# EAGLE design MotorDriver (EAGLE 7.1.0)
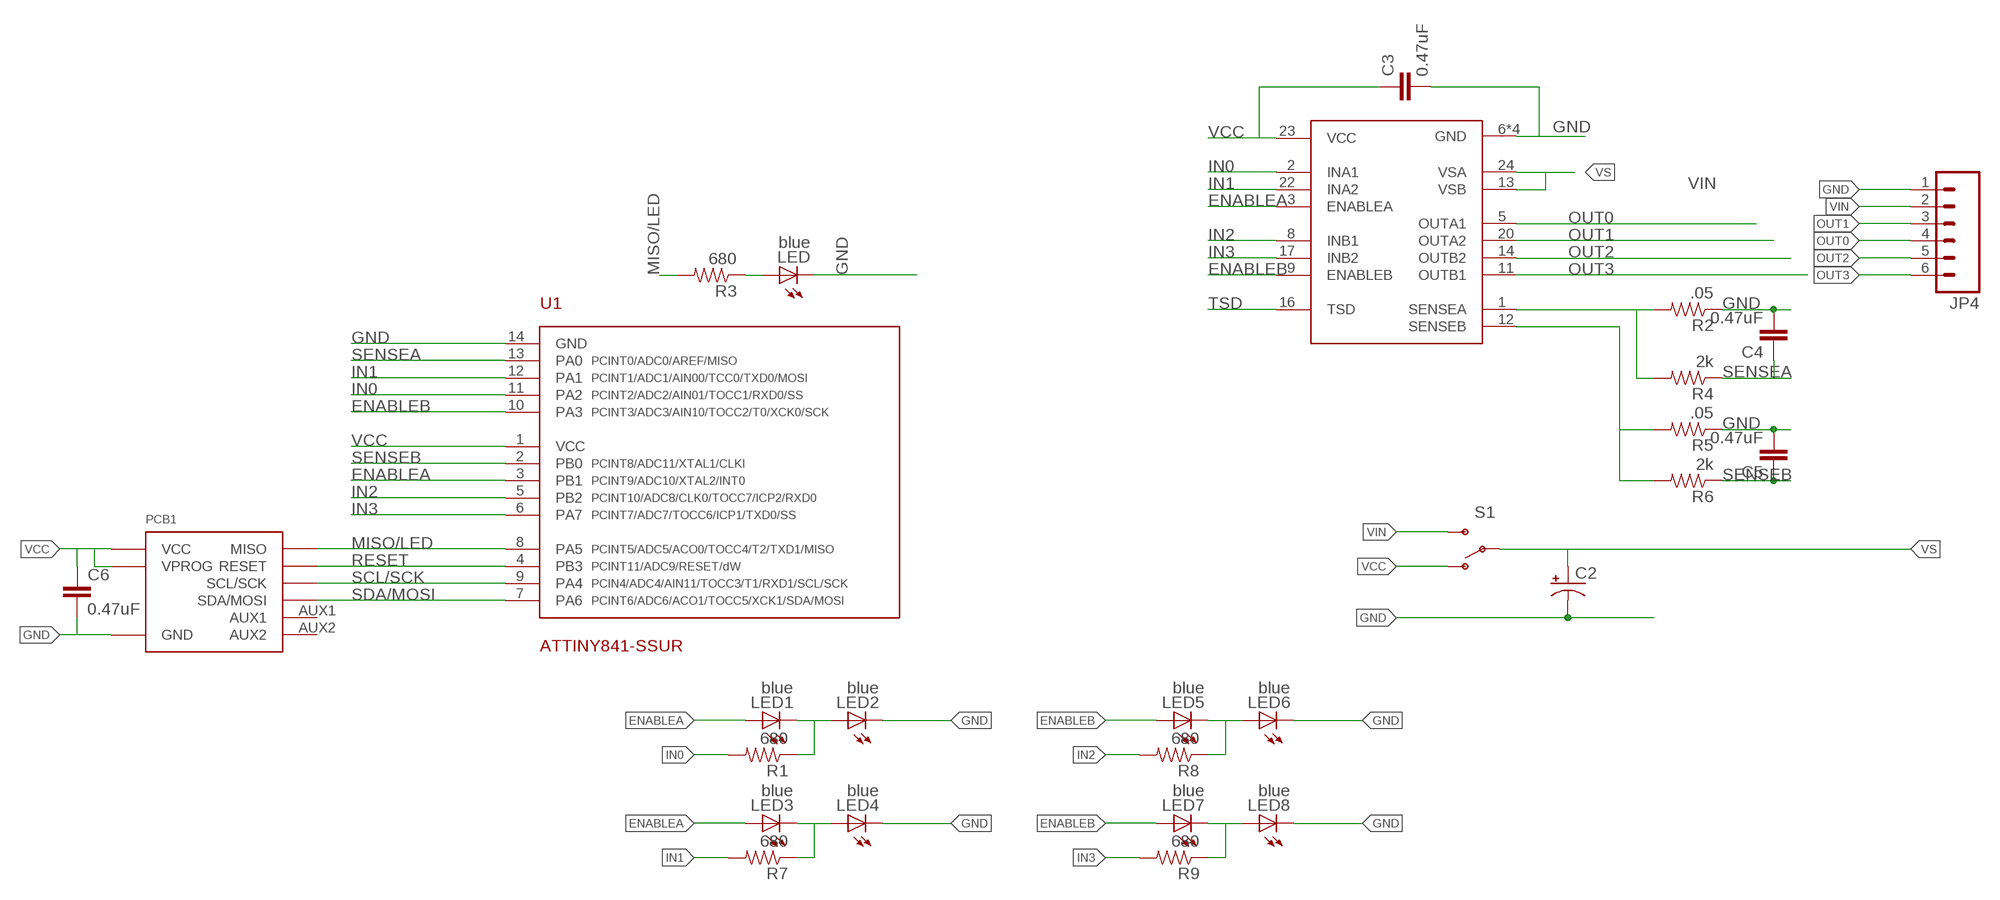
[diagram p0: schematic, sheet 1]

## Parts
C2  CAP_POLC  [PANASONIC_C]
C3  0.47uF  CAP0805  [0805]
C4  0.47uF  CAP0805  [0805]
C5  0.47uF  CAP0805  [0805]
C6  0.47uF  CAP0805  [0805]
JP4  M063.5MM-6  [SCREWTERMINAL-3.5MM-6]
LED  blue  LED-0805-BLUE  [0805-LED]
LED1  blue  LED-0805-BLUE  [0805-LED]
LED2  blue  LED-0805-BLUE  [0805-LED]
LED3  blue  LED-0805-BLUE  [0805-LED]
LED4  blue  LED-0805-BLUE  [0805-LED]
LED5  blue  LED-0805-BLUE  [0805-LED]
LED6  blue  LED-0805-BLUE  [0805-LED]
LED7  blue  LED-0805-BLUE  [0805-LED]
LED8  blue  LED-0805-BLUE  [0805-LED]
PCB1  MAGDEVICE-V2-DOUBLE  [MAGDEVICE-V2-DOUBLE]
R1  680  RESISTOR0805-RES  [0805]
R2  .05  RESISTOR0805-RES  [0805]
R3  680  RESISTOR0805-RES  [0805]
R4  2k  RESISTOR0805-RES  [0805]
R5  .05  RESISTOR0805-RES  [0805]
R6  2k  RESISTOR0805-RES  [0805]
R7  680  RESISTOR0805-RES  [0805]
R8  680  RESISTOR0805-RES  [0805]
R9  680  RESISTOR0805-RES  [0805]
S1  SWITCH-SPDTPTH_LOCK  [SWITCH-SPDT_LOCK.007S]
U1  ATTINY841-SSUR  ATTINY841  [SOIC-14]
U2  NJM2670  [SOP-24-E3]

## Nets
ENABLEA: LED1.A LED3.A U1.3(PB1) U2.3(ENABLEA)
ENABLEB: LED5.A LED7.A U1.10(PA3) U2.9(ENABLEB)
GND: C2.- C3.2 C4.2 C5.2 C6.2 JP4.1 LED2.C LED4.C LED6.C LED8.C LED.C PCB1.GND R2.1 R5.1 U1.14(GND) U2.6(GND) U2.7(GND) U2.18(GND) U2.19(GND)
IN0: R1.2 U1.11(PA2) U2.2(INA1)
IN1: R7.2 U1.12(PA1) U2.22(INA2)
IN2: R8.2 U1.5(PB2) U2.8(INB1)
IN3: R9.2 U1.6(PA7) U2.17(INB2)
MISO/LED: PCB1.MISO R3.2 U1.8(PA5)
N$1: LED1.C LED2.A R1.1
N$2: R2.2 R4.2 U2.1(SENSEA)
N$3: R5.2 R6.2 U2.12(SENSEB)
N$4: LED3.C LED4.A R7.1
N$5: LED.A R3.1
N$6: LED5.C LED6.A R8.1
N$7: LED7.C LED8.A R9.1
OUT0: JP4.4 U2.5(OUTA1)
OUT1: JP4.3 U2.20(OUTA2)
OUT2: JP4.5 U2.14(OUTB2)
OUT3: JP4.6 U2.11(OUTB1)
RESET: PCB1.RESET U1.4(PB3)
SCL/SCK: PCB1.SCL(SCL/SCK) U1.9(PA4)
SDA/MOSI: PCB1.SDA(SDA/MOSI) U1.7(PA6)
SENSEA: C4.1 R4.1 U1.13(PA0)
SENSEB: C5.1 R6.1 U1.2(PB0)
TSD: U2.16(TSD)
VCC: C3.1 C6.1 PCB1.VCC PCB1.VPROG S1.1(O) U1.1(VCC) U2.23(VCC)
VIN: JP4.2 S1.3(S)
VS: C2.+ S1.2(P) U2.13(VSB) U2.24(VSA)
Unconnected: PCB1.AUX1 PCB1.AUX2

## Library data of the parts
C2 = SparkFun-Capacitors:CAP_POL: Capacitor Polarized These are standard SMD and PTH capacitors. Normally 10uF, 47uF, and 100uF in electrolytic and tantalum varieties. Always verify the external diameter of the through hole cap, it varies with capacity, voltage, and manufacturer. The EIA devices should be standard.
C3-C6 = SparkFun-Capacitors:CAP: Capacitor Standard 0603 ceramic capacitor, and 0.1" leaded capacitor.
JP4 = SparkFun-Connectors:M06: Header 6 Standard 6-pin 0.1" header. Use with straight break away headers (SKU : PRT-00116), right angle break away headers (PRT-00553), swiss pins (PRT-00743), machine pins (PRT-00117), and female headers (PRT-00115). Molex polarized connector foot print use with SKU : PRT-08094 with associated crimp pins and housings. NOTES ON THE VARIANTS LOCK and LOCK_LONGPADS... This footprint was designed to help hold the alignment of a through-hole component (i.e. 6-pin header) while soldering it into place. You may notice that each hole has been shifted either up or down by 0.005 of an inch from it's more standard position (which is a perfectly straight line). This slight alteration caused the pins (the squares in the middle) to touch the edges of the holes. Because they are alternating, it causes a "brace" to hold the component in place. 0.005 has proven to be the perfect amount of "off-center" position when using our standard breakaway headers. Although looks a little odd when you look at the bare footprint, once you have a header in there, the alteration is very hard to notice. Also,if you push a header all the way into place, it is covered up entirely on the bottom side. This idea of altering the position of holes to aid alignment will be further integrated into the Sparkfun Library for other footprints. It can help hold any component with 3 or more connection pins.
LED LED1-LED8 = Modulo:LED: LED; PARTNUM: LTST-C171TBKT
PCB1 = Modulo:MAGDEVICE
R1-R9 = SparkFun-Passives:RESISTOR: Resistor Basic schematic elements and footprints for 0603, 1206, and PTH resistors.
S1 = SparkFun-Electromechanical:SWITCH-SPDT: SPDT Switch Simple slide switch, Spark Fun Electronics SKU : COM-00102 DPDT SMT slide switch, AYZ0202, SWCH-08179
U1 = Modulo:ATTINY841
U2 = IntegerLabs:NJM2670

## Board
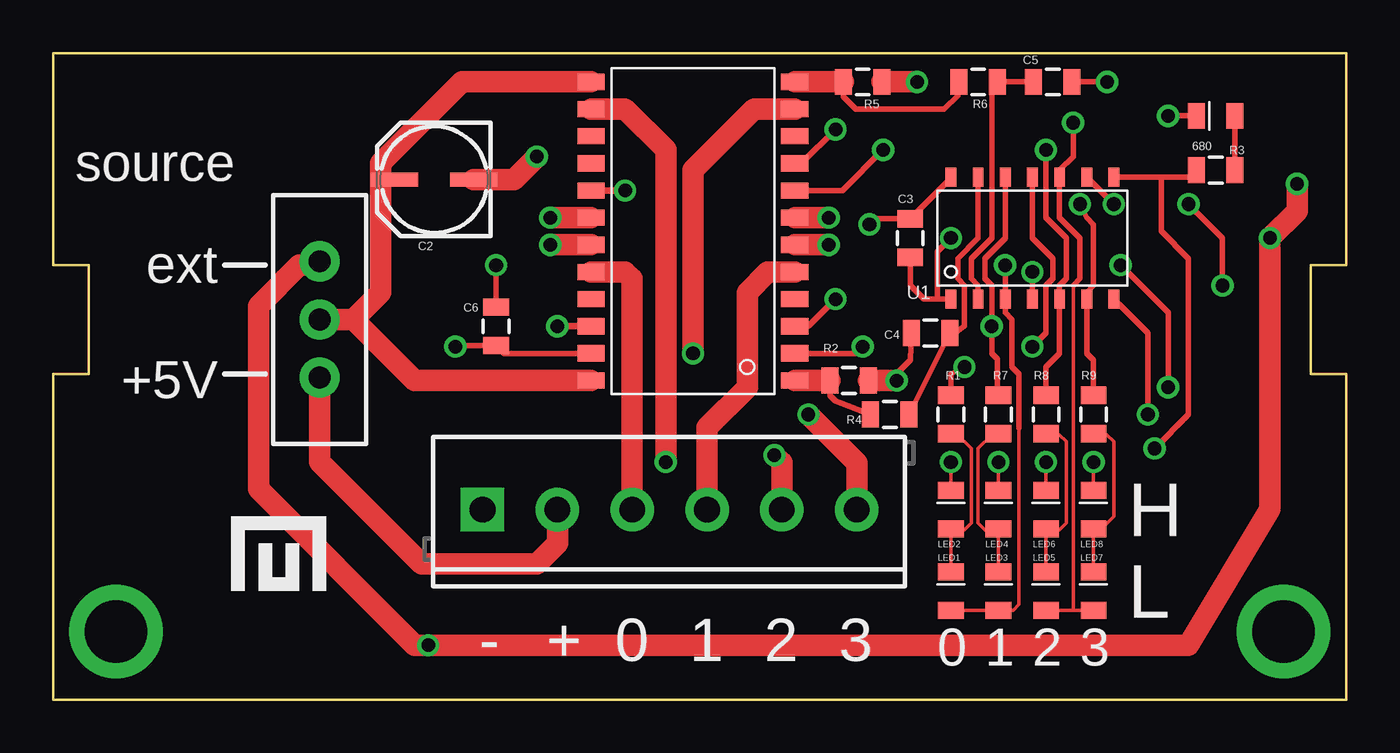
[diagram p1: board, top side]
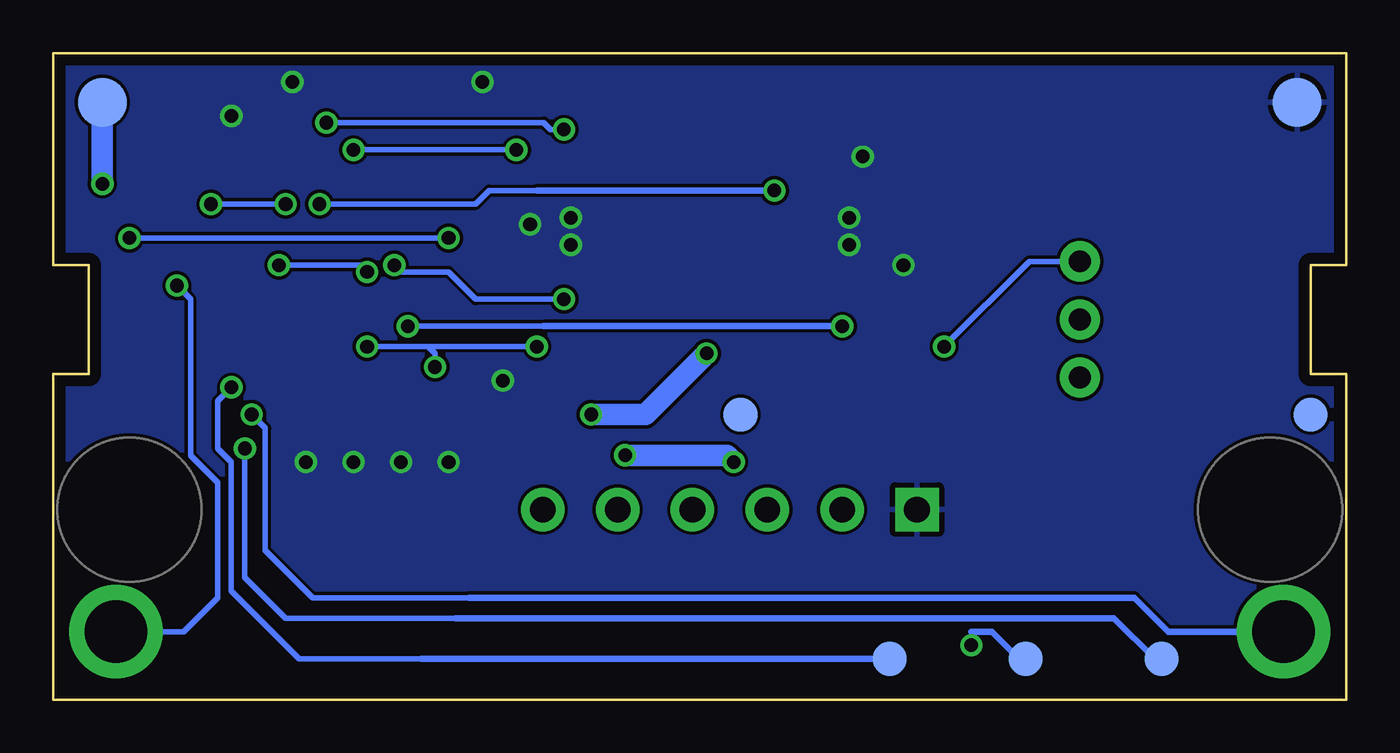
[diagram p2: board, bottom side, seen from below]

Size 60.45 x 30.23 mm. Coordinates in mm from the lower left corner, seen from the top.
Copper layers (1*16): Top 0.0178mm / dielectric 59mil / Bottom 0.0178mm
Design rules "SSC-EAGLE-2Lyr_v1.0.0.3": minimum track width 6mil, minimum drill 14mil, track to track 6mil, track to pad 6mil, pad to pad 6mil, via to via 6mil, smd to smd 6mil, copper to edge 20mil, drill to drill 16mil, minimum pad ring 8mil, minimum via ring 8mil, stop-mask expansion 3mil, vias tented up to drill 0mil, thermal gap 10mil

### Footprints (pad centres in the part's own frame; a part is rotated, then mirrored left to right if it is on the bottom)
PANASONIC_C = smd 2.2 x 0.65: + 1.9,-0.2; - -1.8,-0.2
0805 = smd 0.8 x 1.2: 1 -0.9,0; 2 0.9,0
SCREWTERMINAL-3.5MM-6 = drill 1.2 pad 2.032 square: 1 0,0 | drill 1.2 pad 2.032: 2 3.5,0; 3 7,0; 4 10.5,0; 5 14,0; 6 17.5,0
0805-LED = smd 1.2 x 0.8: A 0,-0.9; C 0,0.9
MAGDEVICE-V2-DOUBLE = smd 1.587 x 1.587 bottom: AUX1 1.905,13.335; AUX2 28.575,13.335; MISO 8.89,1.905; RESET 21.59,1.905; VPROG 15.24,1.905 | smd 2.286 x 2.286 bottom: GND 2.54,27.94; VCC 58.42,27.94 | drill 2.921: SCL 57.785,3.175; SDA 3.175,3.175
SWITCH-SPDT_LOCK.007S = drill 1.016 pad 1.88: 1 0,2.718; 2 0,0; 3 0,-2.718
SOIC-14 = smd 0.508 x 0.889: 1 0,-3.175; 2 1.27,-3.175; 3 2.54,-3.175; 4 3.81,-3.175; 5 5.08,-3.175; 6 6.35,-3.175; 7 7.62,-3.175; 8 7.62,2.54; 9 6.35,2.54; 10 5.08,2.54; 11 3.81,2.54; 12 2.54,2.54; 13 1.27,2.54; 14 0,2.54
SOP-24-E3 = smd 0.762 x 1.27: 1 -6.35,-4.445; 2 -5.08,-4.445; 3 -3.81,-4.445; 4 -2.54,-4.445; 5 -1.27,-4.445; 6 0,-4.445; 7 1.27,-4.445; 8 2.54,-4.445; 9 3.81,-4.445; 10 5.08,-4.445; 11 6.35,-4.445; 12 7.62,-4.445; 13 7.62,5.08; 14 6.35,5.08; 15 5.08,5.08; 16 3.81,5.08; 17 2.54,5.08; 18 1.27,5.08; 19 0,5.08; 20 -1.27,5.08; 21 -2.54,5.08; 22 -3.81,5.08; 23 -5.08,5.08; 24 -6.35,5.08

### Placement (x,y rotation side)
C2  17.84,24.13 180 top
C3  40.07,21.59 90 top
C4  41.02,17.14 180 top
C5  46.74,28.89 0 top
C6  20.7,17.46 90 top
JP4  20.07,8.89 0 top
LED  54.36,27.3 90 top
LED1  41.97,5.08 0 top
LED2  41.97,8.89 0 top
LED3  44.2,5.08 0 top
LED4  44.2,8.89 0 top
LED5  46.42,5.08 0 top
LED6  46.42,8.89 0 top
LED7  48.64,5.08 0 top
LED8  48.64,8.89 0 top
PCB1  -0.25,0 0 top
R1  41.97,13.34 90 top
R2  37.21,14.92 180 top
R3  54.36,24.77 180 top
R4  39.12,13.34 180 top
R5  37.85,28.89 180 top
R6  43.24,28.89 180 top
R7  44.2,13.34 90 top
R8  46.42,13.34 90 top
R9  48.64,13.34 90 top
S1  12.45,17.78 0 top
U1  41.97,21.91 0 top
U2  30.23,21.27 90 top

### Tracks (layer width: path | path; a pad name or v marks a point on that pad's centre or on a via)
ENABLEA  (via drill 0.64)
  Top 0.159: LED1.A LED3.A 44.88,4.18 45.15,4.45 45.15,12.7
  Top 0.254: U2.3 35.31,17.46 v36.58,18.73 | v44.51,20.32 U1.3 44.51,18.1 44.83,17.78 44.83,15.56 45.15,15.24 45.15,12.7
  Bottom 0.254: v36.58,18.73 40.7,18.73 41.97,20 44.51,20 v44.51,20.32
ENABLEB  (via drill 0.64)
  Top 0.159: LED7.A 47.69,4.18 | 47.69,4.18 LED5.A | 47.69,19.37 47.69,4.18
  Top 0.254: v47.69,26.99 47.69,25.4 47.05,24.77 U1.10 47.05,22.54 48.01,21.59 48.01,19.68 47.69,19.37 | U2.9 34.99,25.08 v36.58,26.67
  Bottom 0.254: v47.69,26.99 37.53,26.99 37.21,26.67 v36.58,26.67
GND  (via drill 0.64)
  Top 0.159: LED2.C v41.97,11.11 | LED4.C v44.2,11.11 | LED6.C v46.42,11.11 | LED8.C v48.64,11.11
  Top 0.254: C6.2 v20.7,20.32 | U1.14 41.97,24.39 C3.2 38.43,22.49 v38.16,22.23 | v39.43,14.92 39.43,15.24 40.07,15.88 C4.2 | C5.2 v49.28,28.89 | LED.C v52.13,27.3
  Top 1.016: U2.6 v36.26,21.27 | U2.7 v36.26,22.54 | U2.18 v23.24,22.54 | U2.19 v23.24,21.27 | R5.1 v40.39,28.89 | R2.1 v39.43,14.92 | C2.- 21.54,24.33 v22.61,25.4
  pour Bottom: -0.25,0 -0.25,30.48 60.71,30.48 60.71,0
IN0  (via drill 0.64)
  Top 0.254: U2.2 37.53,16.19 v37.85,16.51 | v45.78,16.51 46.42,17.14 46.42,19.37 46.74,19.68 46.74,20.64 45.78,21.59 U1.11 | R1.2 41.97,15.24 v42.61,15.56
  Bottom 0.254: v37.85,16.51 42.93,16.51 | 42.93,16.51 v45.78,16.51 | v42.61,15.56 42.61,16.19 42.93,16.51
IN1  (via drill 0.64)
  Top 0.254: U1.12 44.51,21.59 43.56,20.64 43.56,19.68 43.88,19.37 v43.88,17.46 43.88,16.19 44.14,15.93 44.14,14.29 R7.2
  Top 0.305: U2.22 v23.56,17.46
  Bottom 0.254: 37.53,17.46 v43.88,17.46
  Bottom 0.305: v23.56,17.46 37.53,17.46
IN2  (via drill 0.64)
  Top 0.254: v46.42,25.72 46.42,22.54 47.37,21.59 47.37,19.68 47.05,19.37 U1.5 47.05,16.19 46.42,15.56 R8.2 | U2.8 36.89,23.81 v38.8,25.72
  Bottom 0.254: v46.42,25.72 v38.8,25.72
IN3  (via drill 0.64)
  Top 0.254: v48.01,23.18 48.32,22.54 48.64,22.23 48.64,19.37 48.32,19.05 U1.6 48.32,16.19 48.64,15.88 R9.2
  Top 0.305: U2.17 v26.73,23.81
  Bottom 0.254: v48.01,23.18 40.7,23.18 40.07,23.81 37.85,23.81
  Bottom 0.305: v26.73,23.81 37.85,23.81
MISO/LED  (via drill 0.64)
  Top 0.254: U1.8 51.82,24.45 | 51.82,24.45 53.14,24.45 R3.2 | 51.82,24.45 51.82,21.91 53.09,20.64 53.09,13.34 v51.5,11.75
  Bottom 0.254: 41.66,3.81 49.59,3.81 51.5,5.71 v51.5,11.75
  Bottom 0.305: PCB1.MISO 8.95,1.91 10.86,3.81 41.66,3.81
N$1
  Top 0.159: LED1.C LED2.A 42.03,7.94 42.61,7.94 42.93,8.26 42.93,11.75 42.24,12.44 R1.1
N$2
  Top 0.254: R2.2 36.31,14.23 36.58,13.97 R4.2
  Top 1.016: U2.1 R2.2
N$3
  Top 0.254: R5.2 36.95,28.2 37.53,27.62 41.66,27.62 42.29,28.26 42.29,28.84 R6.2
  Top 1.016: U2.12 R5.2
N$4
  Top 0.159: LED3.C LED4.A 44.14,7.94 43.56,7.94 43.24,8.26 43.24,11.75 43.88,12.38 44.2,12.38
  Top 0.254: R7.1 44.2,12.38
N$5
  Top 0.254: R3.1 LED.A
N$6
  Top 0.159: LED5.C LED6.A 46.47,7.94 47.05,7.94 47.37,8.26 47.37,12.06 47.05,12.38 46.42,12.38
  Top 0.254: R8.1 46.42,12.38
N$7
  Top 0.159: LED7.C LED8.A 48.59,7.94 48.96,7.94 49.59,8.57 49.59,12.06 49.28,12.38 48.69,12.38 R9.1
OUT0
  Top 1.016: JP4.4 30.57,12.72 32.45,14.61 32.45,19.05 33.4,20 U2.5
OUT1
  Top 1.016: U2.20 26.73,20 27.05,19.68 27.05,8.9 JP4.3
OUT2  (via drill 0.64)
  Top 1.016: JP4.5 34.07,11.08 v33.72,11.43 | v28.64,11.11 28.64,25.72 26.73,27.62 U2.14
  Bottom 1.016: v33.72,11.43 28.96,11.43 v28.64,11.11
OUT3  (via drill 0.64)
  Top 1.016: JP4.6 37.57,11.07 v35.31,13.34 | v29.91,16.19 29.91,24.77 32.77,27.62 U2.11
  Bottom 1.016: v35.31,13.34 32.77,13.34 v29.91,16.19
RESET  (via drill 0.64)
  Top 0.254: v49.91,20.32 52.13,18.1 v52.13,14.61 | v45.78,20 U1.4
  Bottom 0.254: 43.24,1.91 48.96,1.91 52.13,5.08 52.13,11.11 52.77,11.75 52.77,13.97 v52.13,14.61 | v49.91,20.32 46.1,20.32 v45.78,20
  Bottom 0.305: PCB1.RESET 43.24,1.91
SCL/SCK  (via drill 0.64)
  Top 0.254: v53.09,23.18 54.67,21.59 v54.67,19.37 | U1.9 v49.59,23.18
  Bottom 0.254: PCB1.SCL 54.36,3.17 52.77,4.76 52.77,10.16 54.04,11.43 54.04,18.73 v54.67,19.37 | v49.59,23.18 v53.09,23.18
SDA/MOSI  (via drill 0.64)
  Top 0.254: v51.18,13.34 51.18,17.14 U1.7
  Bottom 0.254: 41.02,4.76 48.32,4.76 50.55,6.99 50.55,12.7 v51.18,13.34
  Bottom 0.305: PCB1.SDA 8.32,3.17 9.91,4.76 41.02,4.76
SENSEA
  Top 0.254: R4.1 C4.1 42.24,17.2 42.61,17.46 42.61,19.37 42.29,19.68 42.29,20.64 43.24,21.59 U1.13
SENSEB
  Top 0.254: C5.1 R6.1 43.88,28.63 43.88,21.59 42.93,20.64 42.93,19.68 43.24,19.37 U1.2
VCC  (via drill 0.64)
  Top 0.254: U2.23 21.07,16.19 C6.1 18.85,16.56 v18.8,16.51 | C3.1 40.07,19.37 40.7,18.73 U1.1 41.34,18.73 41.34,20.95 v41.97,21.59
  Top 1.016: v58.17,24.13 58.17,22.86 v56.9,21.59 56.9,8.89 53.09,2.54 v17.53,2.54 16.89,2.54 9.59,9.84 9.59,18.41 11.49,20.32 12.27,20.32 S1.1
  Bottom 0.254: v17.53,2.54 17.53,3.17 | v41.97,21.59 v56.9,21.59 | S1.1 14.81,20.5 v18.8,16.51
  Bottom 0.305: PCB1.VPROG 15.3,1.91 16.57,3.17 17.53,3.17
  Bottom 1.016: PCB1.VCC v58.17,24.13
VIN
  Top 1.016: JP4.2 23.57,7.31 22.61,6.35 17.21,6.35 12.45,11.11 S1.3
VS
  Top 0.305: C2.+ 15.5,24.33 15.3,24.13
  Top 1.016: U2.13 19.11,28.89 15.3,25.08 15.3,24.13 15.3,19.05 14.03,17.78 | U2.24 16.89,14.92 14.03,17.78 | 14.03,17.78 S1.2

### Text on the board
tPlace: source | ext | +5V | H | L | 0 | 1 | 2 | 3
tNames: - | + | 0 | 1 | 2 | 3